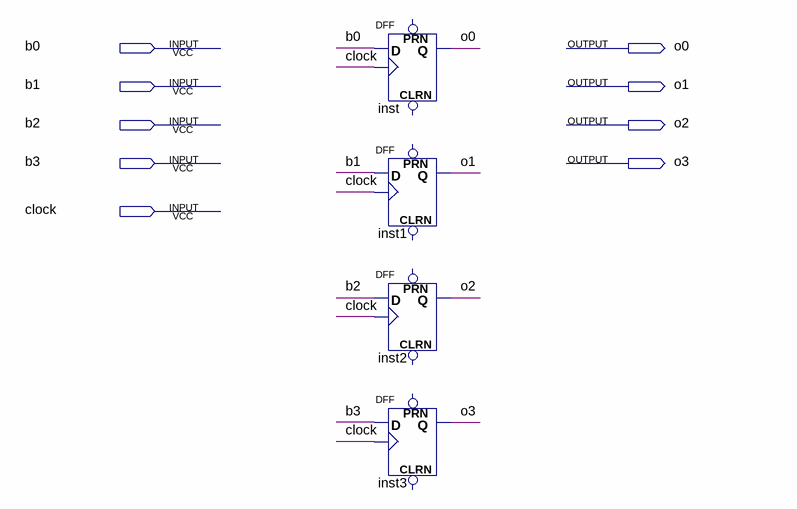
[diagram p0: schematic sheet]
// Quartus schematic rom.bdf as structural Verilog: 4 symbols, 9 pins
module rom (
  input  b0,
  input  b1,
  input  b2,
  input  b3,
  input  clock,
  output o0,
  output o1,
  output o2,
  output o3
);

  DFF inst (.CLK(clock), .D(b0), .Q(o0));  // open: CLRN, PRN
  DFF inst1 (.CLK(clock), .D(b1), .Q(o1));  // open: CLRN, PRN
  DFF inst2 (.CLK(clock), .D(b2), .Q(o2));  // open: CLRN, PRN
  DFF inst3 (.CLK(clock), .D(b3), .Q(o3));  // open: CLRN, PRN
endmodule
